# Altium project HyperCar.PrjPcb
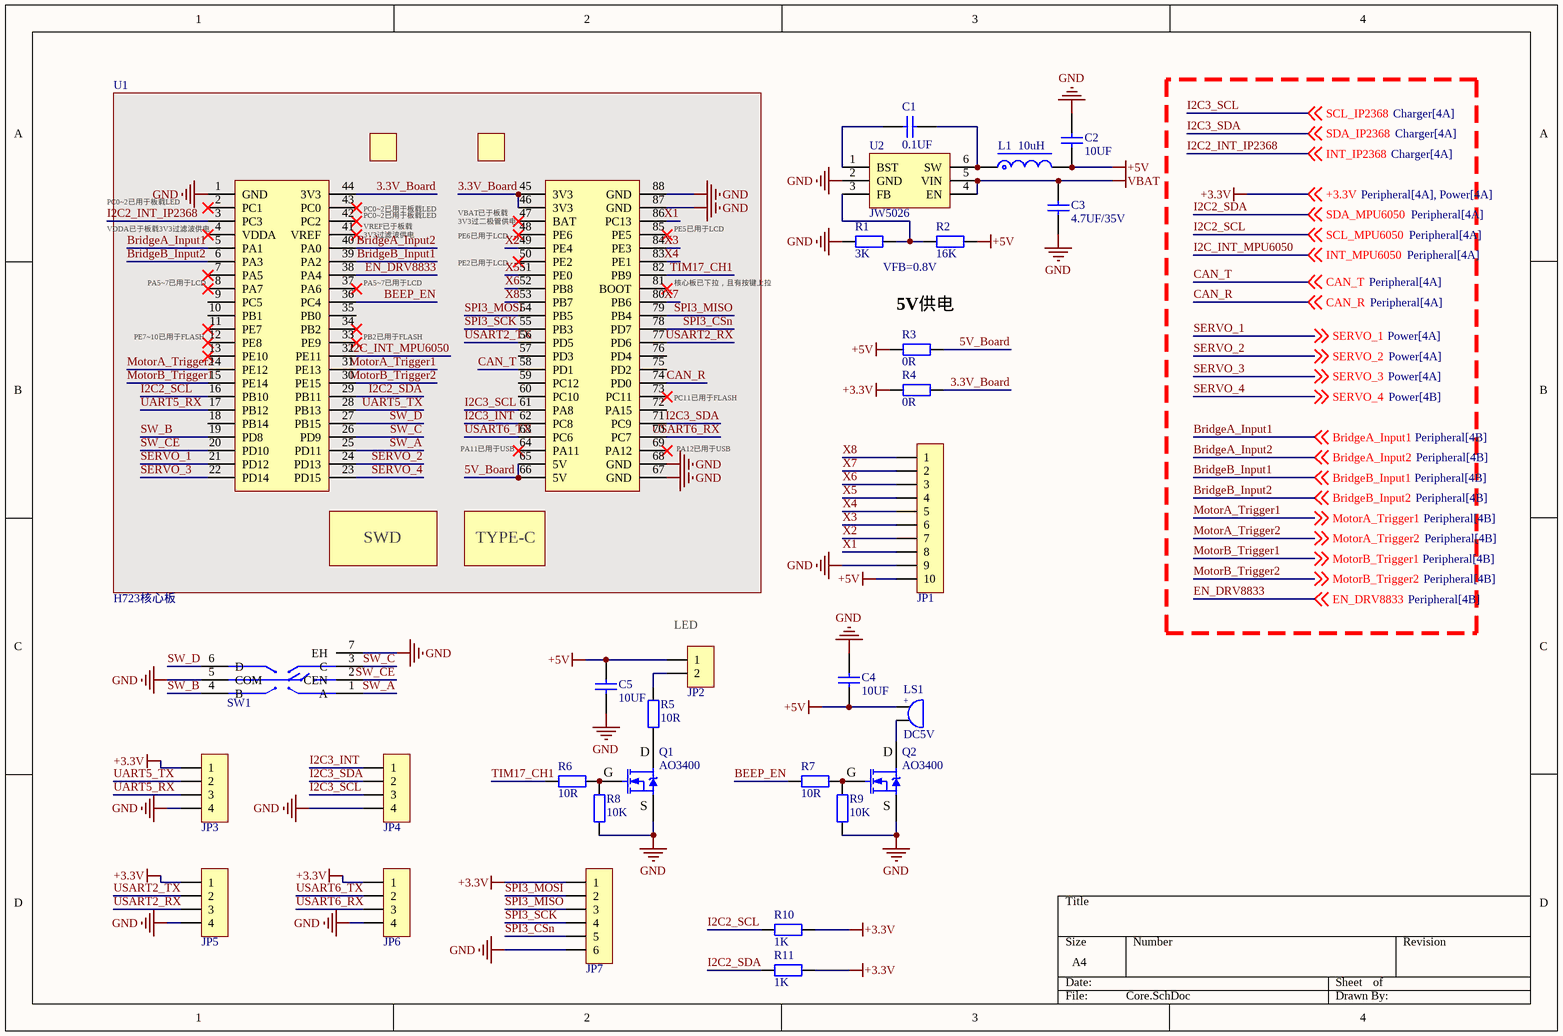
[diagram p0: Core.SchDoc]
4 sheets, 146 parts. Net scope: global (net labels, ports and power ports of the same name join across sheets).
Board file: PCB1.PcbDoc
Sheets:
  Core.SchDoc
  Charger.SchDoc
  Peripheral.SchDoc
  Power.SchDoc

## Sheet Core.SchDoc
size A4; SheetNumber: 1; SheetTotal: 4

### Parts
C1  0.1UF  [C0402_NS]
C2  10UF  [C0805_NS]
C3  4.7UF/35V  [C0603_NS]
C4  10UF  [C0805_NS]
C5  10UF  [C0805_NS]
JP1  HDR-1X10  [HDR2.54-WI-10P]  (value not drawn)
JP2  HDR-1X2  [XH2.54-WI-2P]  (value not drawn)
JP3  HDR-1X4  [XH2.54-WI-4P]  (value not drawn)
JP4  HDR-1X4  [XH2.54-WI-4P]  (value not drawn)
JP5  HDR-1X4  [XH2.54-WI-4P]  (value not drawn)
JP6  HDR-1X4  [HDR2.54-WI-4P]  (value not drawn)
JP7  HDR-1X6  [HDR2.54-WI-6P]  (value not drawn)
L1  10uH  [L-SMD-0420]
LS1  DC5V  [BEEP 5x9x5.5]
Q1  AO3400  [SOT23-3_L2.9_W1.3_P0.95]
Q2  AO3400  [SOT23-3_L2.9_W1.3_P0.95]
R1  3K  [R0402_NS]
R2  16K  [R0402_NS]
R3  0R  [R0805_NS]
R4  0R  [R0805_NS]
R5  10R  [R0603_NS]
R6  10R  [R0603_NS]
R7  10R  [R0603_NS]
R8  10K  [R0603_NS]
R9  10K  [R0603_NS]
R10  1K  [R0402_NS]
R11  1K  [R0402_NS]
SW1  TM-4175-B-A  [SW-SMD_TM-4175-B-X]  (value not drawn)
U1  H723核心板  [H723核心板]
U2  JW5026  [SOT23-6_L3.0_W1.7_P0.95]

### Nets
+3.3V: JP3.1 JP5.1 JP6.1 JP7.1 R4.1 R10.2 R11.2 ; off-sheet +3.3V
+5V: C2.2 C4.1 C5.2 JP1.10 JP2.1 L1.2 LS1.1 R2.1 R3.1
GND: C2.1 C3.1 C4.2 C5.1 JP1.9 JP3.4 JP4.4 JP5.4 JP6.4 JP7.6 Q1.2(S) Q2.2(S) R1.2 R8.2 R9.2 SW1.5(COM) SW1.7(EH) U1.1(GND) U1.67(GND) U1.68(GND) U1.87(GND) U1.88(GND) U2.2(GND)
VBAT: C3.2 U2.4(EN) U2.5(VIN)
3.3V_Board: R4.2 U1.44(3V3) U1.45(3V3) U1.46(3V3)
5V_Board: R3.2 U1.65(5V) U1.66(5V)
BEEP_EN: R7.2 U1.36(PC4)
BridgeA_Input1: U1.5(PA1) ; off-sheet BridgeA_Input1
BridgeA_Input2: U1.40(PA0) ; off-sheet BridgeA_Input2
BridgeB_Input1: U1.39(PA2) ; off-sheet BridgeB_Input1
BridgeB_Input2: U1.6(PA3) ; off-sheet BridgeB_Input2
CAN_R: U1.74(PD0) ; off-sheet CAN_R
CAN_T: U1.58(PD1) ; off-sheet CAN_T
EN_DRV8833: U1.38(PA4) ; off-sheet EN_DRV8833
I2C2_INT_IP2368: U1.3(PC3) ; off-sheet INT_IP2368  [also labelled INT_IP2368]
I2C2_SCL: R10.1 U1.16(PB10) ; off-sheet SCL_MPU6050  [also labelled SCL_MPU6050]
I2C2_SDA: R11.1 U1.29(PB11) ; off-sheet SDA_MPU6050  [also labelled SDA_MPU6050]
I2C3_INT: JP4.1 U1.62(PC8)
I2C3_SCL: JP4.3 U1.61(PA8) ; off-sheet SCL_IP2368  [also labelled SCL_IP2368]
I2C3_SDA: JP4.2 U1.71(PC9) ; off-sheet SDA_IP2368  [also labelled SDA_IP2368]
I2C_INT_MPU6050: U1.32(PE11) ; off-sheet INT_MPU6050  [also labelled INT_MPU6050]
MotorA_Trigger1: U1.31(PE13) ; off-sheet MotorA_Trigger1
MotorA_Trigger2: U1.14(PE12) ; off-sheet MotorA_Trigger2
MotorB_Trigger1: U1.15(PE14) ; off-sheet MotorB_Trigger1
MotorB_Trigger2: U1.30(PE15) ; off-sheet MotorB_Trigger2
SERVO_1: U1.21(PD12) ; off-sheet SERVO_1
SERVO_2: U1.24(PD13) ; off-sheet SERVO_2
SERVO_3: U1.22(PD14) ; off-sheet SERVO_3
SERVO_4: U1.23(PD15) ; off-sheet SERVO_4
SPI3_CSn: JP7.5 U1.78(PD7)
SPI3_MISO: JP7.3 U1.79(PB4)
SPI3_MOSI: JP7.2 U1.54(PB5)
SPI3_SCK: JP7.4 U1.55(PB3)
SW_A: SW1.1(A) U1.25(PD11)
SW_B: SW1.4(B) U1.19(PD8)
SW_C: SW1.3(C) U1.26(PD9)
SW_CE: SW1.2(CEN) U1.20(PD10)
SW_D: SW1.6(D) U1.27(PB15)
TIM17_CH1: R6.2 U1.82(PB9)
UART5_RX: JP3.3 U1.17(PB12)
UART5_TX: JP3.2 U1.28(PB13)
USART2_RX: JP5.3 U1.77(PD6)
USART2_TX: JP5.2 U1.56(PD5)
USART6_RX: JP6.3 U1.70(PC7)
USART6_TX: JP6.2 U1.63(PC6)
X1: JP1.8 U1.86(PC13)
X2: JP1.7 U1.49(PE4)
X3: JP1.6 U1.84(PE3)
X4: JP1.5 U1.83(PE1)
X5: JP1.4 U1.51(PE0)
X6: JP1.3 U1.52(PB8)
X7: JP1.2 U1.80(PB6)
X8: JP1.1 U1.53(PB7)
NetC1_1: C1.1 U2.1(BST)
NetC1_2: C1.2 L1.1 U2.6(SW)
NetJP2_2: JP2.2 R5.2
NetLS1_2: LS1.2 Q2.3(D)
NetQ1_1: Q1.1(G) R6.1 R8.1
NetQ1_3: Q1.3(D) R5.1
NetQ2_1: Q2.1(G) R7.1 R9.1
NetR1_1: R1.1 R2.2 U2.3(FB)

Not connected (* = marked no-connect by the designer): U1 2(PC1)* 4(VDDA)* 7(PA5)* 8(PA7)* 9(PC5) 10(PB1) 11(PE7)* 12(PE8)* 13(PE10)* 18(PB14) 33(PE9)* 34(PB2)* 35(PB0) 37(PA6)* 41(VREF)* 42(PC2)* 43(PC0)* 47(BAT)* 48(PE6)* 50(PE2)* 57(PD3) 59(PC12) 60(PC10) 64(PA11)* 69(PA12)* 72(PA15) 73(PC11)* 75(PD2) 76(PD4) 81(BOOT)* 85(PE5)*

### Notes on the sheet
- PC0~2已用于板载LED
- VDDA已于板载3V3过滤波供电
- (near U1) PC0~2已用于板载LED
- (near U1) VREF已于板载3V3过滤波供电
- (near U1) VBAT已于板载3V3过二极管供电
- (near U1) PE6已用于LCD
- (near U1) PE5已用于LCD
- (near U1) PA5~7已用于LCD
- (near U1) PE2已用于LCD
- (near U1) 核心板已下拉，且有按键上拉
- VFB=0.8V
- 5V供电
- (near U1) PE7~10已用于FLASH
- (near U1) PB2已用于FLASH
- (near U1) PA11已用于USB
- (near U1) PC11已用于FLASH
- (near U1) PA12已用于USB
- (near JP2) LED
- (in symbol BEEP) +
- (in symbol H723核心板) SWD; TYPE-C

### Library data of the parts
C1-C5 = C: 贴片电容/MLCC电容; BOM名称: MLCC
JP1 = Header 10: 10P接插件; BOM名称: 10P接插件
JP2 = Header 2: 2P接插件; BOM名称: 2P接插件
JP3-JP6 = Header 4: 4P接插件; BOM名称: 4P接插件
JP7 = Header 6: 6P接插件; BOM名称: 6P接插件
L1 = L-Molding Choke: 一体成型电感; BOM名称: 一体成型电感
LS1 = BEEP: 蜂鸣器; BOM名称: 蜂鸣器
Q1 Q2 = AO3400: N沟道 30V/4.2A; BOM名称: N沟道场效应管; 参数: N沟道 30V/4.2A
R1-R11 = R: 贴片电阻; BOM名称: 贴片电阻
SW1 = TM-4175-B-A: 五向开关
U2 = JW5026: 40V/1A/1.1MHz同步降压转换器

## Sheet Charger.SchDoc
size A4; SheetNumber: 2; SheetTotal: 4
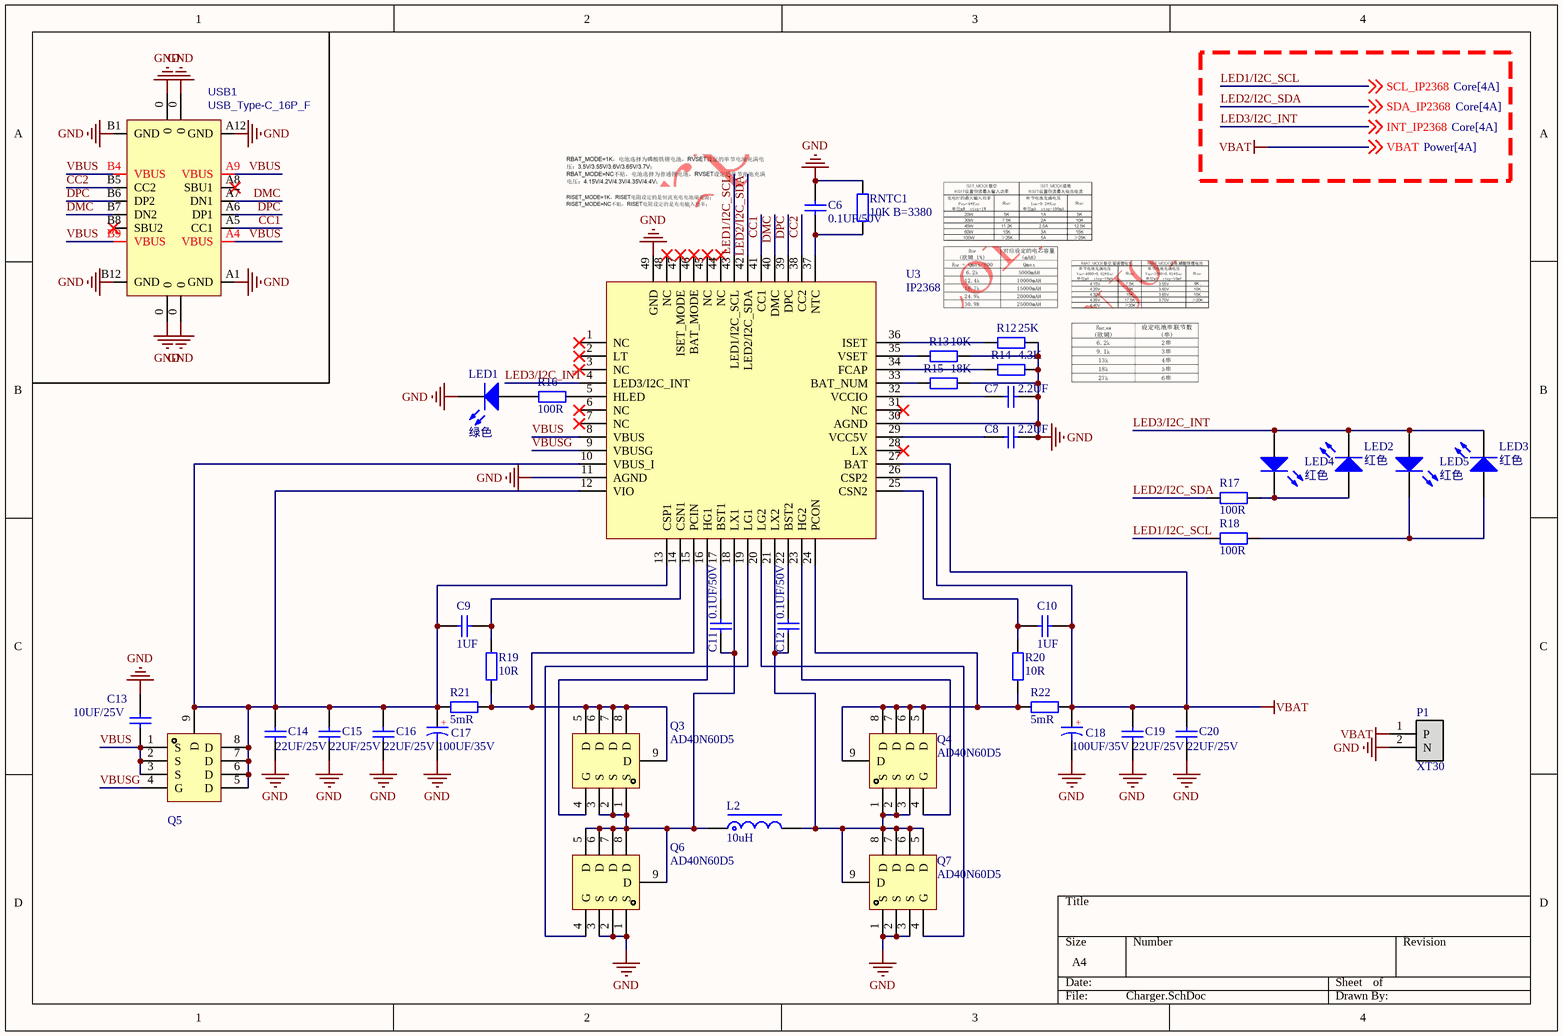
[diagram p1: Charger.SchDoc]

### Parts
C6  0.1UF/50V  [C0603_NS]
C7  2.2UF  [C0603_NS]
C8  2.2UF  [C0603_NS]
C9  1UF  [C0402_NS]
C10  1UF  [C0402_NS]
C11  0.1UF/50V  [C0603_NS]
C12  0.1UF/50V  [C0603_NS]
C13  10UF/25V  [C0805_NS]
C14  22UF/25V  [C0805_NS]
C15  22UF/25V  [C0805_NS]
C16  22UF/25V  [C0805_NS]
C17  100UF/35V  [CE D(6.3*7.7)]
C18  100UF/35V  [CE D(6.3*7.7)]
C19  22UF/25V  [C0805_NS]
C20  22UF/25V  [C0805_NS]
L2  10uH  [L-SMD-1040]
LED1  绿色  [LED0603_G]
LED2  红色  [LED0603_R]
LED3  红色  [LED0603_R]
LED4  红色  [LED0603_R]
LED5  红色  [LED0603_R]
P1  XT30  [XT30PW-M]
Q3  AD40N60D5  [POWERVDFN8_L6.0_W5.0_P1.27]
Q4  AD40N60D5  [POWERVDFN8_L6.0_W5.0_P1.27]
Q5  AON7544  [DFN8_L3.3_W3.3_P0.65]  (value not drawn)
Q6  AD40N60D5  [POWERVDFN8_L6.0_W5.0_P1.27]
Q7  AD40N60D5  [POWERVDFN8_L6.0_W5.0_P1.27]
R12  25K  [R0402_NS]
R13  10K  [R0402_NS]
R14  4.3K  [R0402_NS]
R15  18K  [R0402_NS]
R16  100R  [R0402_NS]
R17  100R  [R0402_NS]
R18  100R  [R0402_NS]
R19  10R  [R0402_NS]
R20  10R  [R0402_NS]
R21  5mR  [R1206_NS]
R22  5mR  [R1206_NS]
RNTC1  10K B=3380  [R0805_NS]
U3  IP2368  [QFN48_L7.0_W7.0_P0.5]
USB1  USB_Type-C_16P_F  [USB_Type-C_SMD_16P_F]

### Nets
GND: C6.2 C7.2 C8.2 C13.2 C14.1 C15.1 C16.1 C17.2 C18.2 C19.1 C20.1 LED1.2(K) P1.2(N) Q6.1(S) Q6.2(S) Q6.3(S) Q7.1(S) Q7.2(S) Q7.3(S) R12.2 R13.2 R14.1 R15.1 RNTC1.2 U3.11(AGND) U3.30(AGND) U3.49(GND) USB1.0 USB1.A1(GND) USB1.A12(GND) USB1.B1(GND) USB1.B12(GND)
VBAT: C10.2 C18.1 C19.2 C20.2 P1.1(P) R22.2 U3.26(CSP2) U3.27(BAT) ; off-sheet VBAT
CC1: U3.41(CC1) USB1.A5(CC1)
CC2: U3.38(CC2) USB1.B5(CC2)
DMC: U3.40(DMC) USB1.A7(DN1) USB1.B7(DN2)
DPC: U3.39(DPC) USB1.A6(DP1) USB1.B6(DP2)
INT_IP2368: LED2.2(K) LED3.2(K) LED4.1(A) LED5.1(A) U3.4(LED3/I2C_INT) ; off-sheet INT_IP2368  [also labelled LED3/I2C_INT]  [project net I2C2_INT_IP2368]
LED1/I2C_SCL: R18.1 U3.43(LED1/I2C_SCL) ; off-sheet SCL_IP2368  [also labelled SCL_IP2368]  [project net I2C3_SCL]
LED2/I2C_SDA: R17.1 U3.42(LED2/I2C_SDA) ; off-sheet SDA_IP2368  [also labelled SDA_IP2368]  [project net I2C3_SDA]
VBUS: C13.1 Q5.1(S) Q5.2(S) Q5.3(S) U3.8(VBUS) USB1.A4(VBUS) USB1.A9(VBUS) USB1.B4(VBUS) USB1.B9(VBUS)
VBUSG: Q5.4(G) U3.9(VBUSG)
NetC6_1: C6.1 RNTC1.1 U3.37(NTC)
NetC7_1: C7.1 U3.32(VCCIO)
NetC8_1: C8.1 U3.29(VCC5V)
NetC9_1: C9.1 C14.2 C15.2 C16.2 C17.1 Q5.5(D) Q5.6(D) Q5.7(D) Q5.8(D) Q5.9(D) R21.1 U3.10(VBUS_I) U3.12(VIO) U3.13(CSP1)
NetC9_2: C9.2 R19.2 U3.14(CSN1)
NetC10_1: C10.1 R20.2 U3.25(CSN2)
NetC11_1: C11.1 L2.1 Q3.1(S) Q3.2(S) Q3.3(S) Q6.5(D) Q6.6(D) Q6.7(D) Q6.8(D) Q6.9(D) U3.18(LX1)
NetC11_2: C11.2 U3.17(BST1)
NetC12_1: C12.1 L2.2 Q4.1(S) Q4.2(S) Q4.3(S) Q7.5(D) Q7.6(D) Q7.7(D) Q7.8(D) Q7.9(D) U3.21(LX2)
NetC12_2: C12.2 U3.22(BST2)
NetLED1_1: LED1.1(A) R16.1
NetLED2_1: LED2.1(A) LED4.2(K) R17.2
NetLED3_1: LED3.1(A) LED5.2(K) R18.2
NetQ3_4: Q3.4(G) U3.16(HG1)
NetQ3_5: Q3.5(D) Q3.6(D) Q3.7(D) Q3.8(D) Q3.9(D) R19.1 R21.2 U3.15(PCIN)
NetQ4_4: Q4.4(G) U3.23(HG2)
NetQ4_5: Q4.5(D) Q4.6(D) Q4.7(D) Q4.8(D) Q4.9(D) R20.1 R22.1 U3.24(PCON)
NetQ6_4: Q6.4(G) U3.19(LG1)
NetQ7_4: Q7.4(G) U3.20(LG2)
NetR12_1: R12.1 U3.36(ISET)
NetR13_1: R13.1 U3.35(VSET)
NetR14_2: R14.2 U3.34(FCAP)
NetR15_2: R15.2 U3.33(BAT_NUM)
NetR16_2: R16.2 U3.5(HLED)

Not connected (* = marked no-connect by the designer): U3 1(NC)* 2(LT)* 3(NC)* 6(NC)* 7(NC)* 28(LX)* 31(NC)* 44(NC)* 45(NC)* 46(BAT_MODE)* 47(ISET_MODE)* 48(NC)*; USB1 A8(SBU1)* B8(SBU2)*

### Notes on the sheet
- (in symbol CE_SMD) +

### Library data of the parts
C6-C16 C19 C20 = C: 贴片电容/MLCC电容; BOM名称: MLCC
C17 C18 = CE_SMD: 贴片固态电容; BOM名称: 贴片电解电容
L2 = L-Molding Choke: 一体成型电感; BOM名称: 一体成型电感
LED1-LED5 = LED: 贴片LED; BOM名称: 贴片LED
P1 = XT30: XT30连接器
Q3 Q4 Q6 Q7 = WSD30100DN56: 类型:N沟道;漏源电压(Vdss):30V;连续漏极电流(Id):100A;功率(Pd):46.3W;导通电阻(RDS(on)@Vgs,Id):4mΩ@10V,20A;; Type: N沟道; Drain Source Voltage (Vdss): 30V; Continuous Drain Current (Id): 100A; Power Dissipation (Pd): 46.3W; Gate Threshold Voltage (Vgs(th)@Id): 2.5V@250uA; Device: WSD30100DN56; LCSC Part Name: N沟道 30V 100A; Supplier Footprint: PDFN-8(5x6); Drain Source On Resistance (RDS(on)@Vgs,Id): 4mΩ@10V,20A
Q5 = AON7544: 类型:N沟道;漏源电压(Vdss):30V;连续漏极电流(Id):50A;导通电阻(RDS(on)Vgs,Id):5.7mΩ@10V,35A;阈值电压(Vgs(th)@Id):2.5V@250uA;; Type: N沟道; Drain Source Voltage (Vdss): 30V; Continuous Drain Current (Id): 50A; Power Dissipation (Pd): 45W; Device: AON7544; LCSC Part Name: N沟道 30V 30A; Supplier Footprint: DFN 3.3x3.3-8; Drain Source On Resistance (RDS(on)@Vgs,Id): 5.7mΩ@10V,35A; Gate Threshold Voltage (Vgs(th)@Id): 2.5V@250uA
R12-R22 RNTC1 = R: 贴片电阻; BOM名称: 贴片电阻
U3 = IP2368: 支持 PD3.0 等多种快充输入输出协议、支持 2~6 节串联电芯 集成升降压驱动 最大充放电功率 100W 的电源管理芯片
USB1 = USB_Type-C_16P_F: USB_Type-C母座; BOM名称: USB_Type-C母座

## Sheet Peripheral.SchDoc
size A4; SheetNumber: 3; SheetTotal: 4
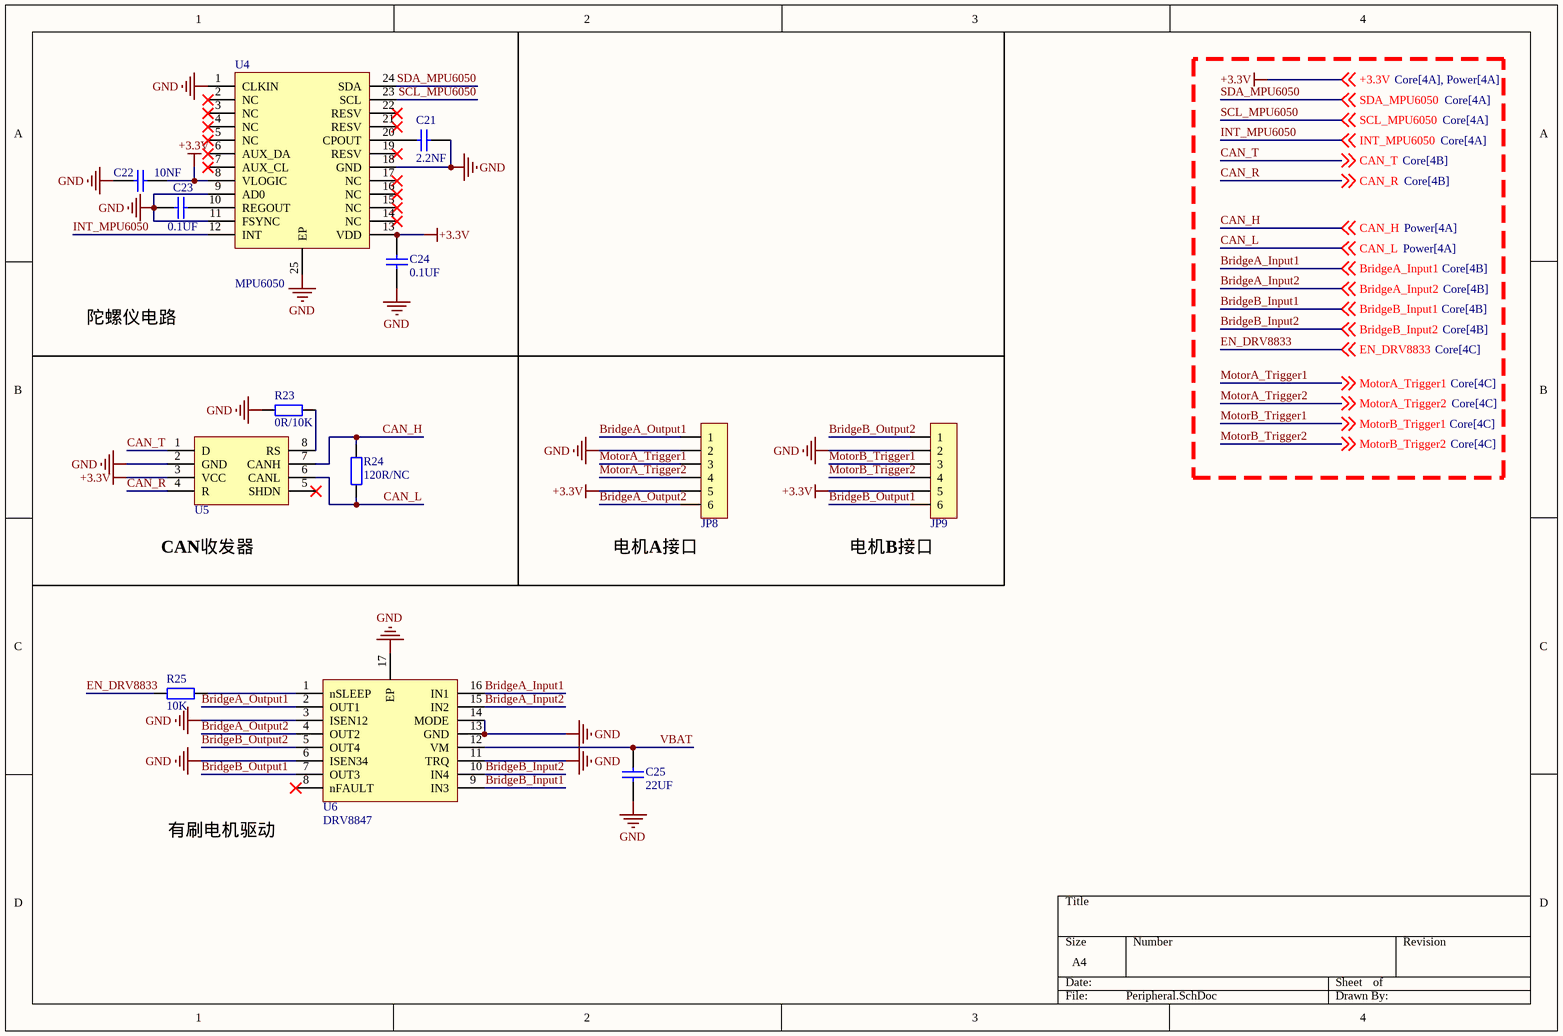
[diagram p2: Peripheral.SchDoc]

### Parts
C21  2.2NF  [C0402_NS]
C22  10NF  [C0402_NS]
C23  0.1UF  [C0402_NS]
C24  0.1UF  [C0402_NS]
C25  22UF  [C0805_NS]
JP8  HDR-1X6  [XH2.54-WI-6P]  (value not drawn)
JP9  HDR-1X6  [XH2.54-WI-6P]  (value not drawn)
R23  0R/10K  [R0402_NS]
R24  120R/NC  [R0402_NS]
R25  10K  [R0402_NS]
U4  MPU6050  [QFN24_L4.0_W4.0_P0.5]
U5  SIT3051  [DFN8_L3.0_W3.0_P0.65]  (value not drawn)
U6  DRV8847  [ETSSOP16_L5.0_W4.4_P0.65]

### Nets
+3.3V: C22.1 C24.2 JP8.5 JP9.5 U4.8(VLOGIC) U4.13(VDD) U5.3(VCC) ; off-sheet +3.3V
GND: C21.2 C22.2 C23.2 C24.1 C25.1 JP8.2 JP9.2 R23.2 U4.1(CLKIN) U4.9(AD0) U4.11(FSYNC) U4.18(GND) U4.25(EP) U5.2(GND) U6.3(ISEN12) U6.6(ISEN34) U6.11(TRQ) U6.13(GND) U6.14(MODE) U6.17(EP)
VBAT: C25.2 U6.12(VM)
BridgeA_Input1: U6.16(IN1) ; off-sheet BridgeA_Input1
BridgeA_Input2: U6.15(IN2) ; off-sheet BridgeA_Input2
BridgeA_Output1: JP8.1 U6.2(OUT1)
BridgeA_Output2: JP8.6 U6.4(OUT2)
BridgeB_Input1: U6.9(IN3) ; off-sheet BridgeB_Input1
BridgeB_Input2: U6.10(IN4) ; off-sheet BridgeB_Input2
BridgeB_Output1: JP9.6 U6.7(OUT3)
BridgeB_Output2: JP9.1 U6.5(OUT4)
CAN_H: R24.2 U5.7(CANH) ; off-sheet CAN_H
CAN_L: R24.1 U5.6(CANL) ; off-sheet CAN_L
CAN_R: U5.4(R) ; off-sheet CAN_R
CAN_T: U5.1(D) ; off-sheet CAN_T
EN_DRV8833: R25.1 ; off-sheet EN_DRV8833
INT_MPU6050: U4.12(INT) ; off-sheet INT_MPU6050  [project net I2C_INT_MPU6050]
MotorA_Trigger1: JP8.3 ; off-sheet MotorA_Trigger1
MotorA_Trigger2: JP8.4 ; off-sheet MotorA_Trigger2
MotorB_Trigger1: JP9.3 ; off-sheet MotorB_Trigger1
MotorB_Trigger2: JP9.4 ; off-sheet MotorB_Trigger2
SCL_MPU6050: U4.23(SCL) ; off-sheet SCL_MPU6050  [project net I2C2_SCL]
SDA_MPU6050: U4.24(SDA) ; off-sheet SDA_MPU6050  [project net I2C2_SDA]
NetC21_1: C21.1 U4.20(CPOUT)
NetC23_1: C23.1 U4.10(REGOUT)
NetR23_1: R23.1 U5.8(RS)
NetR25_2: R25.2 U6.1(nSLEEP)

Not connected (* = marked no-connect by the designer): U4 2(NC)* 3(NC)* 4(NC)* 5(NC)* 6(AUX_DA)* 7(AUX_CL)* 14(NC)* 15(NC)* 16(NC)* 17(NC)* 19(RESV)* 21(RESV)* 22(RESV)*; U5 5(SHDN)*; U6 8(nFAULT)*

### Notes on the sheet
- 陀螺仪电路
- (near U5) CAN收发器
- 电机A接口
- (near JP9) 电机B接口
- 有刷电机驱动

### Library data of the parts
C21-C25 = C: 贴片电容/MLCC电容; BOM名称: MLCC
JP8 JP9 = Header 6: 6P接插件; BOM名称: 6P接插件
R23-R25 = R: 贴片电阻; BOM名称: 贴片电阻
U5 = SIT3051: CAN收发芯片; Manufacturer: Texas Instruments; Protocol: CAN; Number of Drivers/Receivers: 1/1; Duplex: Half; Data Rate: 1Mbps; Voltage - Supply: 3 V ~ 3.6 V; Supplier 1: Digi-Key; Supplier Part Number 1: 296-26344-2-ND; RoHS: RoHS Compliant; Category: Integrated Circuits (ICs); Stock: 5000; Pricing 1: 2500=0.84375 (USD); Packaging: Tape & Reel (TR); Part Status: Active; Type: Transceiver; Operating Temperature: -40°C ~ 85°C; Mounting Type: Surface Mount; Package / Case: 8-SOIC (0.154", 3.90mm Width); Supplier Device Package: 8-SOIC; ComponentLink1URL: http://www.ti.com/lit/ds/symlink/sn65hvd230.pdf; ComponentLink1Description: http://www.ti.com/lit/ds/symlink/sn65hvd230.pdf; Supplier 2: Digi-Key; Supplier Part Number 2: 296-26344-1-ND; Pricing 2: 1=2.05, 10=1.842, 100=1.4809, 500=1.21668, 1000=1.00811 (USD)
U6 = DRV8847: 具有电流调节和独立半桥控制的 18V、2A 双路 H 桥电机驱动器

## Sheet Power.SchDoc
size A4; SheetNumber: 4; SheetTotal: 4
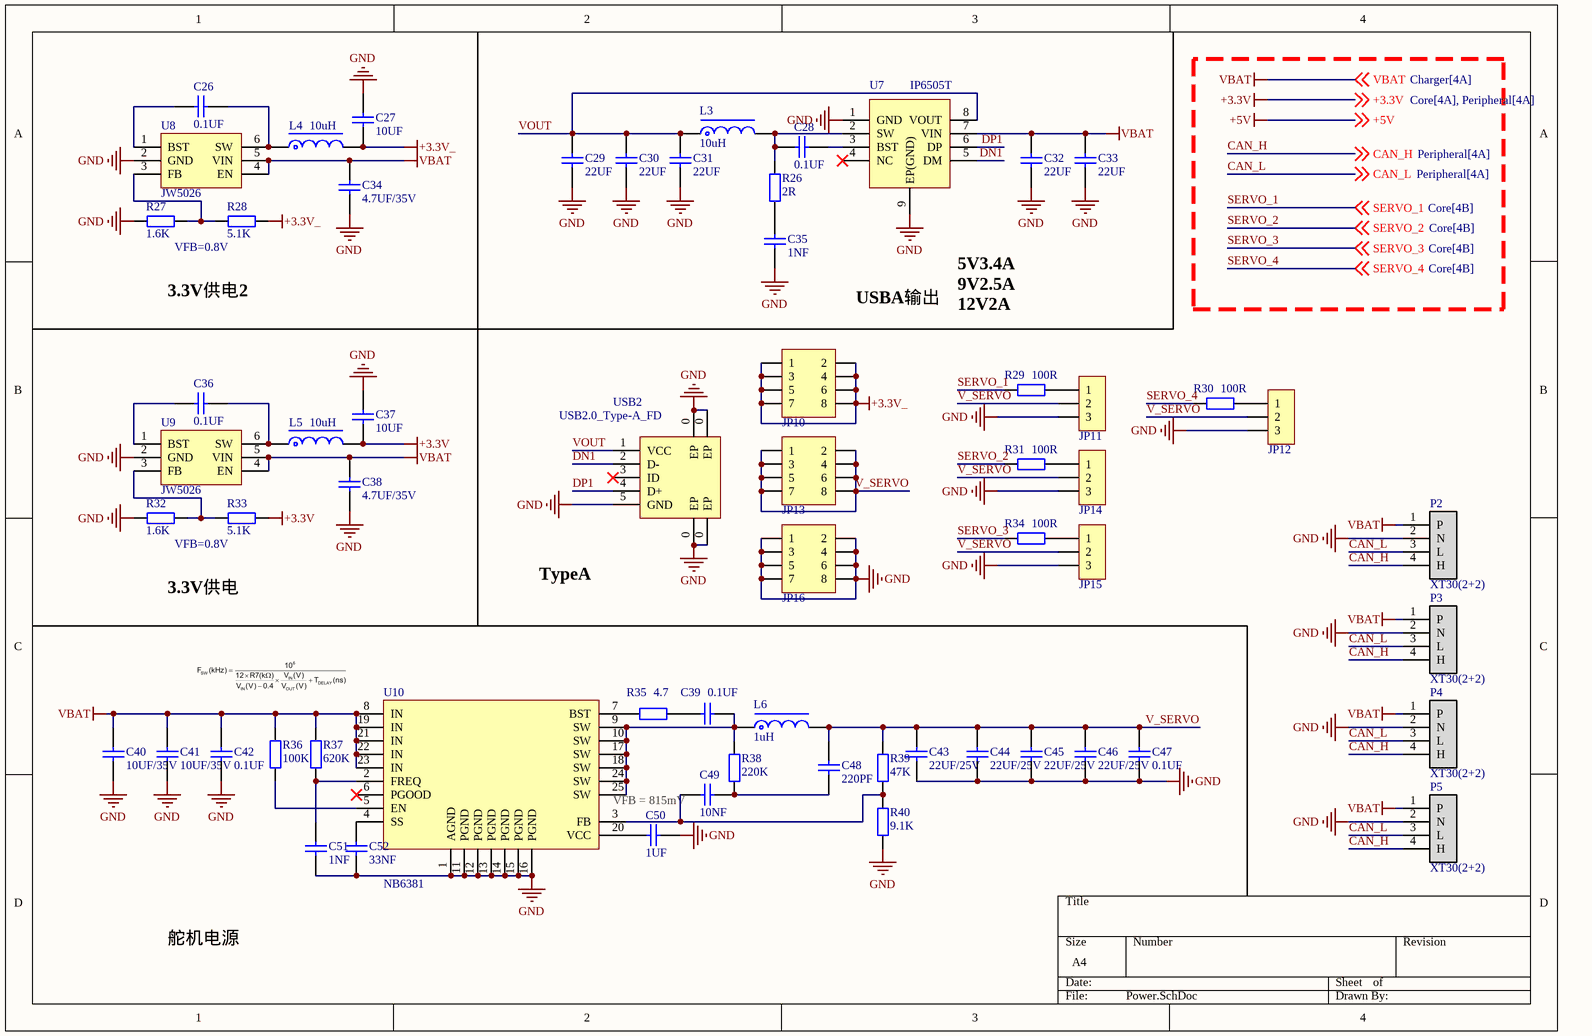
[diagram p3: Power.SchDoc]

### Parts
C26  0.1UF  [C0402_NS]
C27  10UF  [C0805_NS]
C28  0.1UF  [C0402_NS]
C29  22UF  [C0805_NS]
C30  22UF  [C0805_NS]
C31  22UF  [C0805_NS]
C32  22UF  [C0805_NS]
C33  22UF  [C0805_NS]
C34  4.7UF/35V  [C0603_NS]
C35  1NF  [C0402_NS]
C36  0.1UF  [C0402_NS]
C37  10UF  [C0805_NS]
C38  4.7UF/35V  [C0603_NS]
C39  0.1UF  [C0402_NS]
C40  10UF/35V  [C0805_NS]
C41  10UF/35V  [C0805_NS]
C42  0.1UF  [C0603_NS]
C43  22UF/25V  [C0805_NS]
C44  22UF/25V  [C0805_NS]
C45  22UF/25V  [C0805_NS]
C46  22UF/25V  [C0805_NS]
C47  0.1UF  [C0402_NS]
C48  220PF  [C0402_NS]
C49  10NF  [C0402_NS]
C50  1UF  [C0402_NS]
C51  1NF  [C0402_NS]
C52  33NF  [C0402_NS]
JP10  Header 4X2  [HDR2.54-LI-2x4P]  (value not drawn)
JP11  HDR-1X3  [HDR2.54-LI-3P]  (value not drawn)
JP12  HDR-1X3  [HDR2.54-LI-3P]  (value not drawn)
JP13  Header 4X2  [HDR2.54-LI-2x4P]  (value not drawn)
JP14  HDR-1X3  [HDR2.54-LI-3P]  (value not drawn)
JP15  HDR-1X3  [HDR2.54-LI-3P]  (value not drawn)
JP16  Header 4X2  [HDR2.54-LI-2x4P]  (value not drawn)
L3  10uH  [L-SMD-0630]
L4  10uH  [L-SMD-0420]
L5  10uH  [L-SMD-0420]
L6  1uH  [L-SMD-0630]
P2  XT30(2+2)  [XT30(2+2)PW-M]
P3  XT30(2+2)  [XT30(2+2)PW-M]
P4  XT30(2+2)  [XT30(2+2)PW-M]
P5  XT30(2+2)  [XT30(2+2)PW-M]
R26  2R  [R0402_NS]
R27  1.6K  [R0402_NS]
R28  5.1K  [R0402_NS]
R29  100R  [R0402_NS]
R30  100R  [R0402_NS]
R31  100R  [R0402_NS]
R32  1.6K  [R0402_NS]
R33  5.1K  [R0402_NS]
R34  100R  [R0402_NS]
R35  4.7  [R0402_NS]
R36  100K  [R0402_NS]
R37  620K  [R0402_NS]
R38  220K  [R0402_NS]
R39  47K  [R0402_NS]
R40  9.1K  [R0402_NS]
U7  IP6505T  [ESOP8_L5.0_W6.0_P1.27]
U8  JW5026  [SOT23-6_L3.0_W1.7_P0.95]
U9  JW5026  [SOT23-6_L3.0_W1.7_P0.95]
U10  NB6381  [QFN20_L3.0_W4.0-P0.50]
USB2  USB2.0_Type-A_FD  [USB2.0_Type-A_SMD_FD]

### Nets
+3.3V: C37.2 L5.2 R33.1 ; off-sheet +3.3V
+3.3V_: C27.2 JP10.1 JP10.2 JP10.3 JP10.4 JP10.5 JP10.6 JP10.7 JP10.8 L4.2 R28.1
GND: C27.1 C29.1 C30.1 C31.1 C32.1 C33.1 C34.1 C35.1 C37.1 C38.1 C40.1 C41.1 C42.2 C43.1 C44.1 C45.1 C46.1 C47.2 C50.1 C51.2 C52.2 JP11.3 JP12.3 JP14.3 JP15.3 JP16.1 JP16.2 JP16.3 JP16.4 JP16.5 JP16.6 JP16.7 JP16.8 P2.2(N) P3.2(N) P4.2(N) P5.2(N) R27.2 R32.2 R40.1 U7.1(GND) U7.9(EP(GND)) U8.2(GND) U9.2(GND) U10.1(AGND) U10.11(PGND) U10.12(PGND) U10.13(PGND) U10.14(PGND) U10.15(PGND) U10.16(PGND) USB2.0(EP) USB2.5(GND)
VBAT: C32.2 C33.2 C34.2 C38.2 C40.2 C41.2 C42.1 P2.1(P) P3.1(P) P4.1(P) P5.1(P) R36.2 R37.1 U7.7(VIN) U8.4(EN) U8.5(VIN) U9.4(EN) U9.5(VIN) U10.8(IN) U10.19(IN) U10.21(IN) U10.22(IN) U10.23(IN) ; off-sheet VBAT
CAN_H: P2.4(H) P3.4(H) P4.4(H) P5.4(H) ; off-sheet CAN_H
CAN_L: P2.3(L) P3.3(L) P4.3(L) P5.3(L) ; off-sheet CAN_L
DN1: U7.5(DM) USB2.2(D-)
DP1: U7.6(DP) USB2.4(D+)
SERVO_1: R29.1 ; off-sheet SERVO_1
SERVO_2: R31.1 ; off-sheet SERVO_2
SERVO_3: R34.1 ; off-sheet SERVO_3
SERVO_4: R30.1 ; off-sheet SERVO_4
V_SERVO: C43.2 C44.2 C45.2 C46.2 C47.1 C48.2 JP11.2 JP12.2 JP13.1 JP13.2 JP13.3 JP13.4 JP13.5 JP13.6 JP13.7 JP13.8 JP14.2 JP15.2 L6.2 R39.2
VOUT: C29.2 C30.2 C31.2 L3.1 U7.8(VOUT) USB2.1(VCC)
NetC26_1: C26.1 U8.1(BST)
NetC26_2: C26.2 L4.1 U8.6(SW)
NetC28_1: C28.1 L3.2 R26.2 U7.2(SW)
NetC28_2: C28.2 U7.3(BST)
NetC35_2: C35.2 R26.1
NetC36_1: C36.1 U9.1(BST)
NetC36_2: C36.2 L5.1 U9.6(SW)
NetC39_1: C39.1 L6.1 R38.2 U10.9(SW) U10.10(SW) U10.17(SW) U10.18(SW) U10.24(SW) U10.25(SW)
NetC39_2: C39.2 R35.2
NetC48_1: C48.1 C49.1 R38.1
NetC49_2: C49.2 R39.1 R40.2 U10.3(FB)
NetC50_2: C50.2 U10.20(VCC)
NetC51_1: C51.1 R37.2 U10.2(FREQ)
NetC52_1: C52.1 U10.4(SS)
NetJP11_1: JP11.1 R29.2
NetJP12_1: JP12.1 R30.2
NetJP14_1: JP14.1 R31.2
NetJP15_1: JP15.1 R34.2
NetR27_1: R27.1 R28.2 U8.3(FB)
NetR32_1: R32.1 R33.2 U9.3(FB)
NetR35_1: R35.1 U10.7(BST)
NetR36_1: R36.1 U10.5(EN)

Not connected (* = marked no-connect by the designer): U7 4(NC)*; U10 6(PGOOD)*; USB2 3(ID)*

### Notes on the sheet
- VFB=0.8V
- 3.3V供电2
- USBA输出
- 5V3.4A
- 9V2.5A
- 12V2A
- TypeA
- 3.3V供电
- VFB = 815mV
- 舵机电源

### Library data of the parts
C26-C52 = C: 贴片电容/MLCC电容; BOM名称: MLCC
JP10 JP13 JP16 = Header 4X2: 4*2P接插件; BOM名称: 4*2P接插件
JP11 JP12 JP14 JP15 = Header 3: 3P接插件; BOM名称: 3P接插件
L3-L6 = L-Molding Choke: 一体成型电感; BOM名称: 一体成型电感
P2-P5 = XT30(2+2): XT30(2+2)连接器
R26-R40 = R: 贴片电阻; BOM名称: 贴片电阻
U7 = IP6505T: 最大输出 24W，集成各种快充输出协议(DCP/QC2.0/QC3.0/FCP/AFC/SFCP)的 SOC IC
U8 U9 = JW5026: 40V/1A/1.1MHz同步降压转换器
U10 = NB6381: Wide Vin 4.5-28V, 8A, COT Synchronous Step-Down Converter with Internal Bias Supply; Vout: 0.8-13V; Frequency: 200kHz-1MHz; Vin: 4.5-28V
USB2 = USB2.0_Type-A_FD: USB2.0_Type-A母座,带ID; BOM名称: USB2.0_Type-A母座

## Nets that join several sheets
+3.3V: Core (7 pins), Peripheral (7 pins), Power (C37.2 L5.2 R33.1)
GND: Core (23 pins), Charger (32 pins), Peripheral (20 pins), Power (53 pins)
VBAT: Core (C3.2 U2.4 U2.5), Charger (8 pins), Peripheral (C25.2 U6.12), Power (23 pins)
BridgeA_Input1: Core (U1.5), Peripheral (U6.16)
BridgeA_Input2: Core (U1.40), Peripheral (U6.15)
BridgeB_Input1: Core (U1.39), Peripheral (U6.9)
BridgeB_Input2: Core (U1.6), Peripheral (U6.10)
CAN_H: Peripheral (R24.2 U5.7), Power (P2.4 P3.4 P4.4 P5.4)
CAN_L: Peripheral (R24.1 U5.6), Power (P2.3 P3.3 P4.3 P5.3)
CAN_R: Core (U1.74), Peripheral (U5.4)
CAN_T: Core (U1.58), Peripheral (U5.1)
EN_DRV8833: Core (U1.38), Peripheral (R25.1)
I2C2_INT_IP2368: Core (U1.3), Charger (5 pins)
I2C2_SCL: Core (R10.1 U1.16), Peripheral (U4.23)
I2C2_SDA: Core (R11.1 U1.29), Peripheral (U4.24)
I2C3_SCL: Core (JP4.3 U1.61), Charger (R18.1 U3.43)
I2C3_SDA: Core (JP4.2 U1.71), Charger (R17.1 U3.42)
I2C_INT_MPU6050: Core (U1.32), Peripheral (U4.12)
MotorA_Trigger1: Core (U1.31), Peripheral (JP8.3)
MotorA_Trigger2: Core (U1.14), Peripheral (JP8.4)
MotorB_Trigger1: Core (U1.15), Peripheral (JP9.3)
MotorB_Trigger2: Core (U1.30), Peripheral (JP9.4)
SERVO_1: Core (U1.21), Power (R29.1)
SERVO_2: Core (U1.24), Power (R31.1)
SERVO_3: Core (U1.22), Power (R34.1)
SERVO_4: Core (U1.23), Power (R30.1)